# EAGLE design TEST_DCDC (EAGLE 9.6.2)
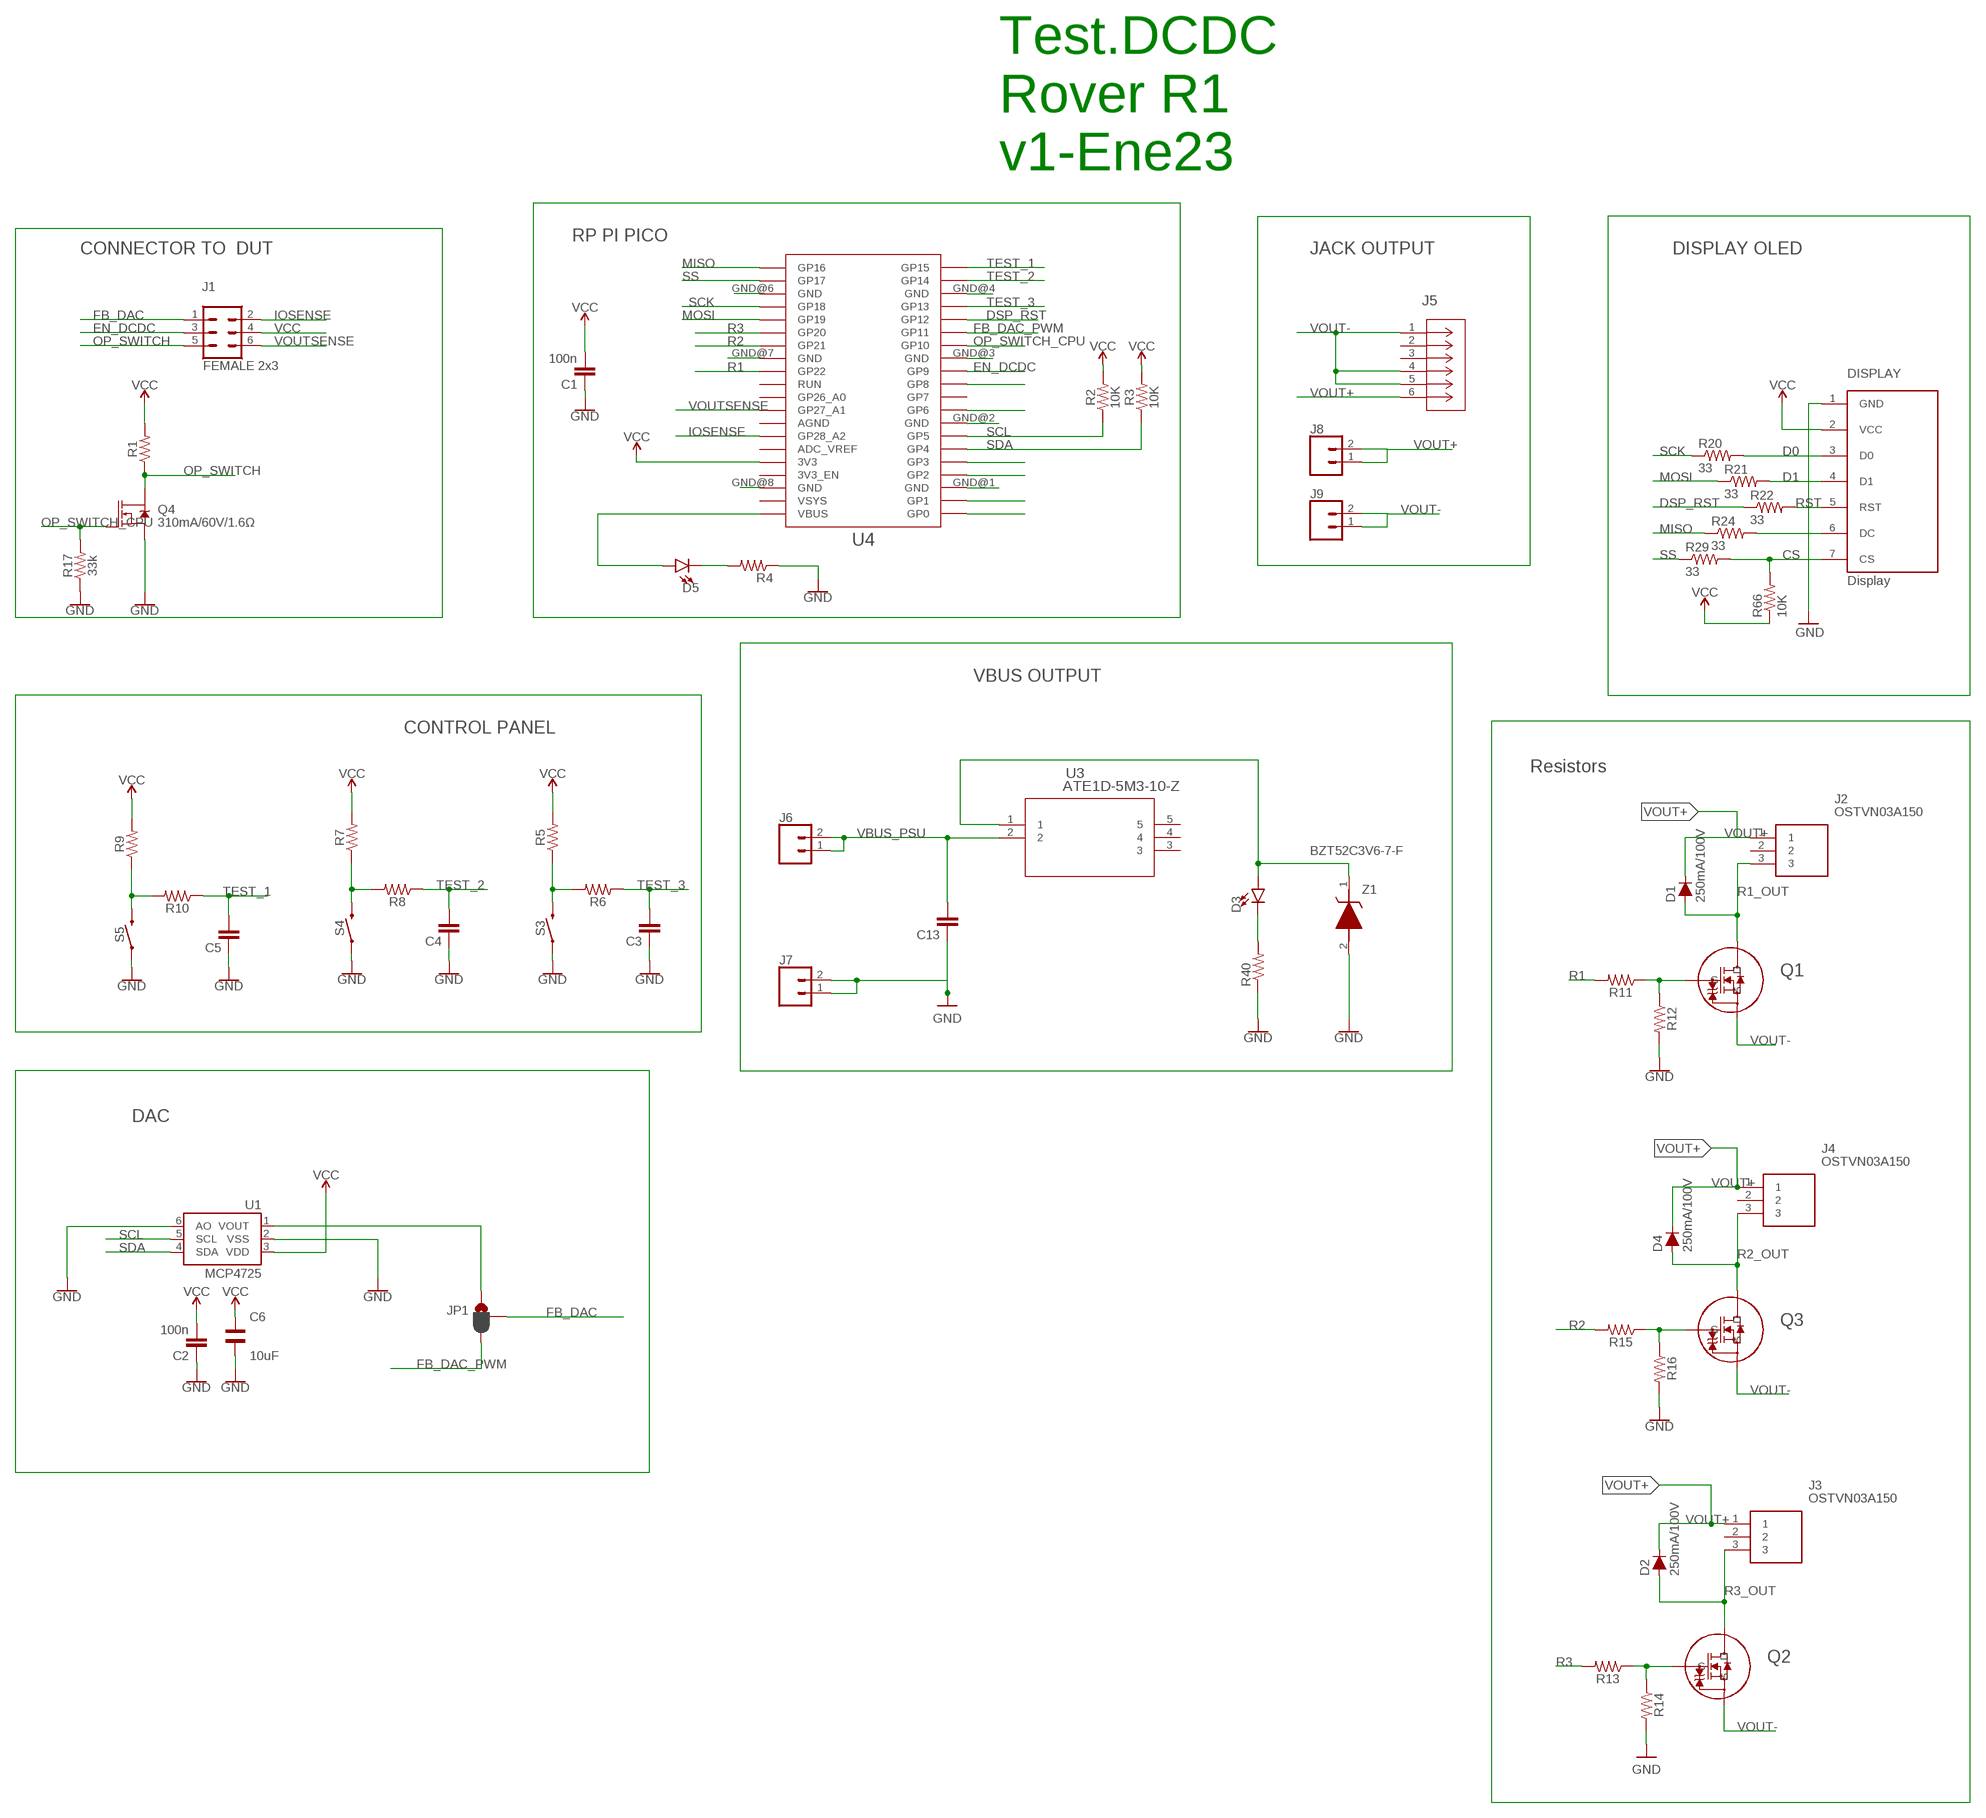
[diagram p0: schematic, sheet 1]

## Parts
C1  100n  C-EUC0805  [C0805]
C2  100n  C-EUC0805  [C0805]
C3  C-EUC0805  [C0805]
C4  C-EUC0805  [C0805]
C5  C-EUC0805  [C0805]
C6  10uF  WCAP-CSGP_1206_885012008001  [WCAP-CSGP_1206]
C13  C-EUC0805  [C0805]
D1  250mA/100V  DIODE-BAS16J  [SOD-323]
D2  250mA/100V  DIODE-BAS16J  [SOD-323]
D3  LED3MM  [LED_3MM]
D4  250mA/100V  DIODE-BAS16J  [SOD-323]
D5  LED3MM  [LED_3MM]
DISPLAY  Display  OLED_LCD  [OLED_LCD]
J1  FEMALE 2x3  CONN_03X2FEMALE  [2X3]
J2  OSTVN03A150  [OSTVN03A150]
J3  OSTVN03A150  [OSTVN03A150]
J4  OSTVN03A150  [OSTVN03A150]
J5  ACJS-MHDR  [CONN_MHDR_AMP]
J6  CONN_02  [1X02]
J7  CONN_02  [1X02]
J8  CONN_02  [1X02]
J9  CONN_02  [1X02]
JP1  JUMPER-SMT_3_1-NC_PASTE_SILK  [SMT-JUMPER_3_1-NC_PASTE_SILK]
Q1  PJA3416AE_R1_00001  [SOT23_PJA3416_PNJ]
Q2  PJA3416AE_R1_00001  [SOT23_PJA3416_PNJ]
Q3  PJA3416AE_R1_00001  [SOT23_PJA3416_PNJ]
Q4  310mA/60V/1.6Ω  MOSFET-NCH-2N7002PW  [SOT323]
R1  RESISTOR0805  [0805]
R2  10K  RESISTOR0805  [0805]
R3  10K  RESISTOR0805  [0805]
R4  10K  RESISTOR0805-RES  [0805]
R5  RESISTOR0805  [0805]
R6  RESISTOR0805  [0805]
R7  RESISTOR0805  [0805]
R8  RESISTOR0805  [0805]
R9  RESISTOR0805  [0805]
R10  RESISTOR0805  [0805]
R11  RESISTOR0805  [0805]
R12  RESISTOR0805  [0805]
R13  RESISTOR0805  [0805]
R14  RESISTOR0805  [0805]
R15  RESISTOR0805  [0805]
R16  RESISTOR0805  [0805]
R17  33k  RESISTOR0805  [0805]
R20  33  RESISTOR0805-RES  [0805]
R21  33  RESISTOR0805-RES  [0805]
R22  33  RESISTOR0805-RES  [0805]
R24  33  RESISTOR0805-RES  [0805]
R29  33  RESISTOR0805-RES  [0805]
R40  10K  RESISTOR0805-RES  [0805]
R66  10K  RESISTOR0805-RES  [0805]
S3  MOMENTARY-SWITCH-SPST-SMD-5.2MM  [TACTILE_SWITCH_SMD_5.2MM]
S4  MOMENTARY-SWITCH-SPST-SMD-5.2MM  [TACTILE_SWITCH_SMD_5.2MM]
S5  MOMENTARY-SWITCH-SPST-SMD-5.2MM  [TACTILE_SWITCH_SMD_5.2MM]
U1  MCP4725  MCP4725SOT-23  [SOT23-6]
U3  ATE1D-5M3-10-Z  [SPDT05_ATE1D_9P5X8_NDC]
U4  RPI_PICO_IG-TH  [RPI_PICO_TH]
Z1  BZT52C3V6-7-F  [SOD3716X135N]

## Nets
CS: DISPLAY.7(CS) R29.2 R66.2
D0: DISPLAY.3(D0) R20.2
D1: DISPLAY.4(D1) R21.2
DSP_RST: R22.1 U4.GP12
EN_DCDC: J1.3 U4.GP9
FB_DAC: J1.1 JP1.2
FB_DAC_PWM: JP1.3 U4.GP11
GND: C1.1 C2.1 C3.1 C4.1 C5.1 C6.1 C13.1 DISPLAY.1(GND) J7.1 J7.2 Q4.2(S) R4.1 R12.2 R14.2 R16.2 R17.1 R40.1 S3.1 S4.1 S5.1 U1.2(VSS) U1.6(AO) U4.GND@1(GND) U4.GND@2(GND) U4.GND@3(GND) U4.GND@4(GND) U4.GND@6(GND) U4.GND@7(GND) U4.GND@8(GND) Z1.2(A)
IOSENSE: J1.2 U4.GP28_A2
MISO: R24.1 U4.GP16
MOSI: R21.1 U4.GP19
N$5: R5.1 R6.2 S3.3
N$6: U4.GP0
N$7: R7.1 R8.2 S4.3
N$9: R9.1 R10.2 S5.3
N$10: U4.GP1
N$13: U4.GP2
N$14: U4.GP3
N$17: DISPLAY.6(DC) R24.2
N$18: JP1.1 U1.1(VOUT)
N$19: Q1.1(G) R11.1 R12.1
N$20: U4.GP6
N$22: U4.GP8
N$24: Q2.1(G) R13.1 R14.1
N$26: D5.K(C) R4.2
N$27: D5.A U4.VBUS
N$28: D3.K(C) R40.2
N$30: Q3.1(G) R15.1 R16.1
OP_SWITCH: J1.5 Q4.3(D) R1.1
OP_SWITCH_CPU: Q4.1(G) R17.2 U4.GP10
R1: R11.2 U4.GP22
R1_OUT: D1.A J2.3 Q1.3(D)
R2: R15.2 U4.GP21
R2_OUT: D4.A J4.3 Q3.3(D)
R3: R13.2 U4.GP20
R3_OUT: D2.A J3.3 Q2.3(D)
RST: DISPLAY.5(RST) R22.2
SCK: R20.1 U4.GP18
SCL: R2.1 U1.5(SCL) U4.GP5
SDA: R3.1 U1.4(SDA) U4.GP4
SS: R29.1 U4.GP17
TEST_1: C5.2 R10.1 U4.GP15
TEST_2: C4.2 R8.1 U4.GP14
TEST_3: C3.2 R6.1 U4.GP13
VBUS: D3.A U3.1 Z1.1(K)
VBUS_PSU: C13.2 J6.1 J6.2 U3.2
VCC: C1.2 C2.2 C6.2 DISPLAY.2(VCC) J1.4 R1.2 R2.2 R3.2 R5.2 R7.2 R9.2 R66.1 U1.3(VDD) U4.3V3
VOUT+: D1.C D2.C D4.C J2.1 J3.1 J4.1 J5.6 J8.1 J8.2
VOUT-: J5.1 J5.4 J5.5 J9.1 J9.2 Q1.2(S) Q2.2(S) Q3.2(S)
VOUTSENSE: J1.6 U4.GP27_A1
Unconnected: J2.2 J3.2 J4.2 J5.2 J5.3 U3.3 U3.4 U3.5 U4.3V3_EN U4.ADC_VREF U4.AGND U4.GP7 U4.GP26_A0 U4.RUN U4.VSYS

## Notes on the sheet
- Test.DCDC
  Rover R1
  v1-Ene23
- RP PI PICO
- CONNECTOR TO  DUT | JACK OUTPUT | DISPLAY OLED
- VBUS OUTPUT
- CONTROL PANEL
- Resistors
- DAC

## Library data of the parts
C1-C5 C13 = rcl:C-EU: CAPACITOR, European symbol; SPICEPREFIX: C
C6 = Wurth_Elektronik_Passive_Capacitors_rev19a:WCAP-CSGP_1206: WCAP-CSGP Ceramic Capacitors Characteristics Multilayer Ceramic Chip Capacitor Recommended soldering:Reflow, for 0603 and 0805 wave soldering is also allowed Operating temperature:-55 °C to +125 °C; Ceramic characteristics: Class I - NPO ; Class II -X7R, X5R High performance ceramic High capacitance stability Minimal aging Termination:Cu/Ni/Sn <http://katalog.we-online.de/media/images/eisos/WCAP-CSGP_pf2.jpg> Details see: http://katalog.we-online.de/en/pbs/WCAP-CSGP-1206? Created: 2015-01-28 2015 (C) Wurth Elektronik
D1 D2 D4 = SparkFun-DiscreteSemi:DIODE: Diode These are standard reverse protection diodes and small signal diodes. SparkFun Products: SparkFun SparkPunk Sound Kit <https://www.sparkfun.com/products/11177> SparkFun ESP8266 Thing <https://www.sparkfun.com/products/13231>; PROD_ID: DIO-09646
D3 D5 = SparkFun-LED:LED: LED (Generic) Standard schematic elements and footprints for 5mm, 3mm, 1206, and 0603 sized LEDs. Generic LEDs with no color specified.; PROD_ID: DIO-08794
DISPLAY = EDCPSU:OLED_LCD
J1 = SparkFun-Connectors:CONN_03X2: Multi connection point. Often used as Generic Header-pin footprint for 0.1 inch spaced/style header connections You can populate with any combo of single row headers, but if you'd like an exact match, check these: Header - 2x3 (Male, 0.1") <https://www.sparkfun.com/products/12807> (PRT-12807) Header - 2x3 (Female, 0.1") <https://www.sparkfun.com/products/13010> (PRT-13010) 2x3 Pin Shrouded Header <https://www.sparkfun.com/products/10877> (PRT-10877) On any of the 0.1 inch spaced packages, you can populate with these: Break Away Headers - Straight <https://www.sparkfun.com/products/116> (PRT-00116) Break Away Male Headers - Right Angle <https://www.sparkfun.com/products/553> (PRT-00553) Female Headers <https://www.sparkfun.com/products/115> (PRT-00115) Break Away Headers - Machine Pin <https://www.sparkfun.com/products/117> (PRT-00117) Break Away Female Headers - Swiss Machine Pin <https://www.sparkfun.com/products/743> (PRT-00743) Special note: the shrouded connector mates well with our 3x2 ribbon cables: Ribbon Crimp Connector - 6-pin (2x3, Female) <https://www.sparkfun.com/products/10651> (PRT-10651) Ribbon Cable - 6 wire (15ft) <https://www.sparkfun.com/products/10646> (PRT-10646); PROD_ID: CONN-11566
J2-J4 = OSTVN03A150:OSTVN03A150: OSTVN03A150 Source: Datasheet <https://www.on-shore.com/wp-content/uploads/OSTVNXXA150.pdf>; ARROW_PART_NUMBER: OSTVN03A150; ARROW_PRICE-STOCK: https://www.arrow.com/en/products/ostvn03a150/on-shore-technology; DESCRIPTION: OSTVN03A150; HEIGHT: 8.8mm; MANUFACTURER_NAME: On-Shore Technology, Inc; MANUFACTURER_PART_NUMBER: OSTVN03A150
J5 = ACJSMHDR:ACJS-MHDR; BUILT_BY: EMA_Matt; COPYRIGHT: Copyright (C) 2018 Accelerated Designs. All rights reserved; MANUFACTURER_PART_NUMBER: ACJS-MHDR; SOURCELIBRARY: Amphenol_2019-10-30; VENDOR: Amphenol
J6-J9 = SparkFun-Connectors:CONN_02: Multi connection point. Often used as Generic Header-pin footprint for 0.1 inch spaced/style header connections On any of the 0.1 inch spaced packages, you can populate with these: Break Away Headers - Straight <https://www.sparkfun.com/products/116> (PRT-00116) Break Away Male Headers - Right Angle <https://www.sparkfun.com/products/553> (PRT-00553) Female Headers <https://www.sparkfun.com/products/115> (PRT-00115) Break Away Headers - Machine Pin <https://www.sparkfun.com/products/117> (PRT-00117) Break Away Female Headers - Swiss Machine Pin <https://www.sparkfun.com/products/743> (PRT-00743) For SCREWTERMINALS and SPRING TERMINALS visit here: Screw Terimnals on SparkFun.com <https://www.sparkfun.com/search/results?term=Screw+Terminals> (5mm/3.5mm/2.54mm spacing) This device is also useful as a general connection point to wire up your design to another part of your project. Our various solder wires solder well into these plated through hole pads. Hook-Up Wire - Assortment (Stranded, 22 AWG) <https://www.sparkfun.com/products/11375> (PRT-11375) Hook-Up Wire - Assortment (Solid Core, 22 AWG) <https://www.sparkfun.com/products/11367> (PRT-11367) View the entire wire category on our website here <https://www.sparkfun.com/categories/141> Special notes: Molex polarized connector foot print use with: PRT-08233 with associated crimp pins and housings. 2.54_SCREWTERM for use with PRT-10571. 3.5mm Screw Terminal footprints for PRT-08084 5mm Screw Terminal footprints for use with PRT-08432
JP1 = SparkFun-Jumpers:JUMPER-SMT_3_1-NC_PASTE: Normally closed solder jumper (1 of 2 connections) This jumper has an aperture in the stencil to allow solder paste to bridge one of the two connections. One connection is normally closed (NC), while the other is normally open (NO). Wick off the solder to open the connection. Reapply solder to reclose the connection. Apply solder to the other side instead to change the current path.
Q1-Q3 = PJA3416AE_R1_00001:PJA3416AE_R1_00001; COPYRIGHT: Copyright (C) 2022 Ultra Librarian. All rights reserved.; DIGI-KEY_PART_NUMBER_1: 3757-PJA3416AE_R1_00001TR-ND; DIGI-KEY_PART_NUMBER_2: 3757-PJA3416AE_R1_00001CT-ND; DIGI-KEY_PART_NUMBER_3: 3757-PJA3416AE_R1_00001DKR-ND; MANUFACTURER_PART_NUMBER: PJA3416AE_R1_00001; MFR_NAME: Panjit
Q4 = SparkFun-DiscreteSemi:MOSFET-NCH: N-channel MOSFETs Voltage controlled devices that allow control of high current outputs. SparkFun Products: SparkFun OpenScale <https://www.sparkfun.com/products/13261> SparkFun Digital Sandbox <https://www.sparkfun.com/products/12651> SparkFun Monster Moto Shield <https://www.sparkfun.com/products/10182> SparkFun MOSFET Power Controller <https://www.sparkfun.com/products/11214>; PROD_ID: TRANS-11151
R1-R3 R5-R17 = SparkFun-Resistors:RESISTOR: Generic Resistor Package
R4 R20-R22 R24 R29 R40 R66 = SparkFun:RESISTOR: Resistor Basic schematic elements and footprints for 0603, 1206, and PTH resistors.
S3-S5 = SparkFun-Switches:MOMENTARY-SWITCH-SPST: Momentary Switch (Pushbutton) - SPST Normally-open (NO) SPST momentary switches (buttons, pushbuttons). Variants PTH-12MM - 12mm square, through-hole Momentary Pushbutton Switch - 12mm Square <https://www.sparkfun.com/products/9190> (COM-09190) PTH-6.0MM, PTH-6.0MM-KIT - 6.0mm square, through-hole Mini Pushbutton Switch <https://www.sparkfun.com/products/97> (COM-00097) KIT package intended for soldering kit's - only one side of pads' copper is exposed. PTH-RIGHT-ANGLE-KIT - Right-angle, through-hole Right Angle Tactile Button <https://www.sparkfun.com/products/10791> - Used on SparkFun BigTime Watch Kit <https://www.sparkfun.com/products/11734> SMD-12MM - 12mm square, surface-mount Tactile Button - SMD (12mm) <https://www.sparkfun.com/products/12993> (COM-12993) Used on SparkFun PicoBoard <https://www.sparkfun.com/products/11888> SMD-4.5MM - 4.5mm Square Trackball Switch Used on SparkFun Blackberry Trackballer Breakout <https://www.sparkfun.com/products/13169> SMD-4.6MMX2.8MM - 4.60mm x 2.80mm, surface mount Used on SparkFun SAMD21 Mini Breakout <https://www.sparkfun.com/products/13664> SMD-5.2MM, SMD-5.2-REDUNDANT - 5.2mm square, surface-mount Mini Pushbutton Switch - SMD <https://www.sparkfun.com/products/8720> (COM-08720) Used on Arduino Pro Mini <https://www.sparkfun.com/products/11114> REDUNDANT package connects both switch circuits together SMD-6.0X3.5MM - 6.0 x 3.5mm, surface mount Momentary Reset Switch SMD <https://www.sparkfun.com/products/8229> (COM-08229) SMD-6.2MM-TALL - 6.2mm square, surface mount Tactile Button - SMD (6mm) <https://www.sparkfun.com/products/12992> Used on SparkFun Digital Sandbox <https://www.sparkfun.com/products/12651> SMD-RIGHT-ANGLE - Right-angle, surface mount Used on SparkFun Block for Intel® Edison - Arduino <https://www.sparkfun.com/products/13036>; PROD_ID: SWCH-08247; SF_SKU: COM-08720
U1 = SparkFun-IC-Conversion:MCP4725: MCP4725 DAC Microchip 12-bit I2C DAC, SOT23-6 Datasheet <https://cdn.sparkfun.com/datasheets/BreakoutBoards/MCP4725_2009.pdf> SparkFun Products SparkFun I2C DAC Breakout - MCP4725 <https://www.sparkfun.com/products/12918> (BOB-12918); PROD_ID: IC-08886
U3 = ATE1D-5M3-10-Z:ATE1D-5M3-10-Z; COPYRIGHT: Copyright (C) 2022 Ultra Librarian. All rights reserved.; DIGI-KEY_PART_NUMBER_1: 563-1158-ND; MANUFACTURER_PART_NUMBER: ATE1D-5M3-10-Z; MFR_NAME: Nidec Copal Electronics
U4 = RaspberryPi_Pico:RPI_PICO_IG
Z1 = BZT52C3V6-7-F:BZT52C3V6-7-F: Diodes Inc BZT52C3V6-7-F Zener Diode, 3.6V 6% 500 mW SMT 2-Pin SOD-123 Source: Datasheet <https://www.diodes.com/assets/Datasheets/ds18004.pdf>; ARROW_PART_NUMBER: BZT52C3V6-7-F; ARROW_PRICE-STOCK: https://www.arrow.com/en/products/bzt52c3v6-7-f/diodes-incorporated?region=nac; DESCRIPTION: Diodes Inc BZT52C3V6-7-F Zener Diode, 3.6V 6% 500 mW SMT 2-Pin SOD-123; HEIGHT: 1.35mm; MANUFACTURER_NAME: Diodes Inc.; MANUFACTURER_PART_NUMBER: BZT52C3V6-7-F; MOUSER_PART_NUMBER: 621-BZT52C3V6-F; MOUSER_PRICE-STOCK: https://www.mouser.co.uk/ProductDetail/Diodes-Incorporated/BZT52C3V6-7-F?qs=We1mx2pNWM9dxcfB67aIQA%3D%3D

## Board
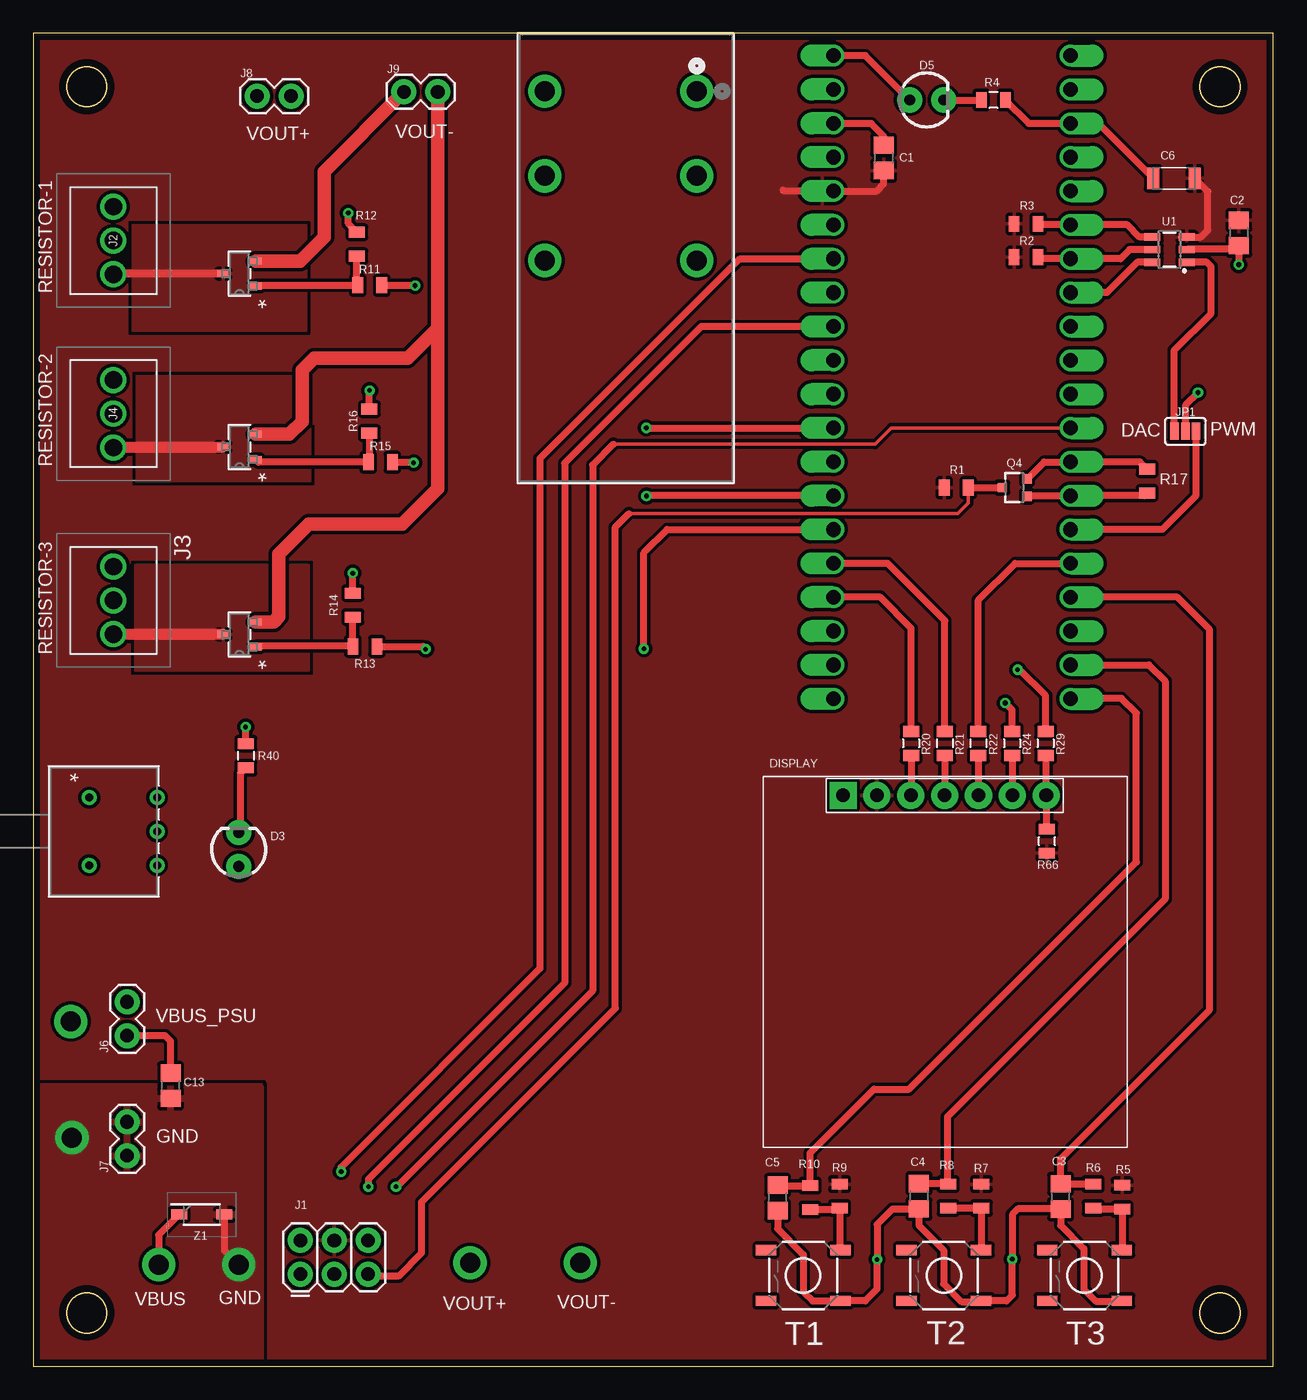
[diagram p1: board, top side]
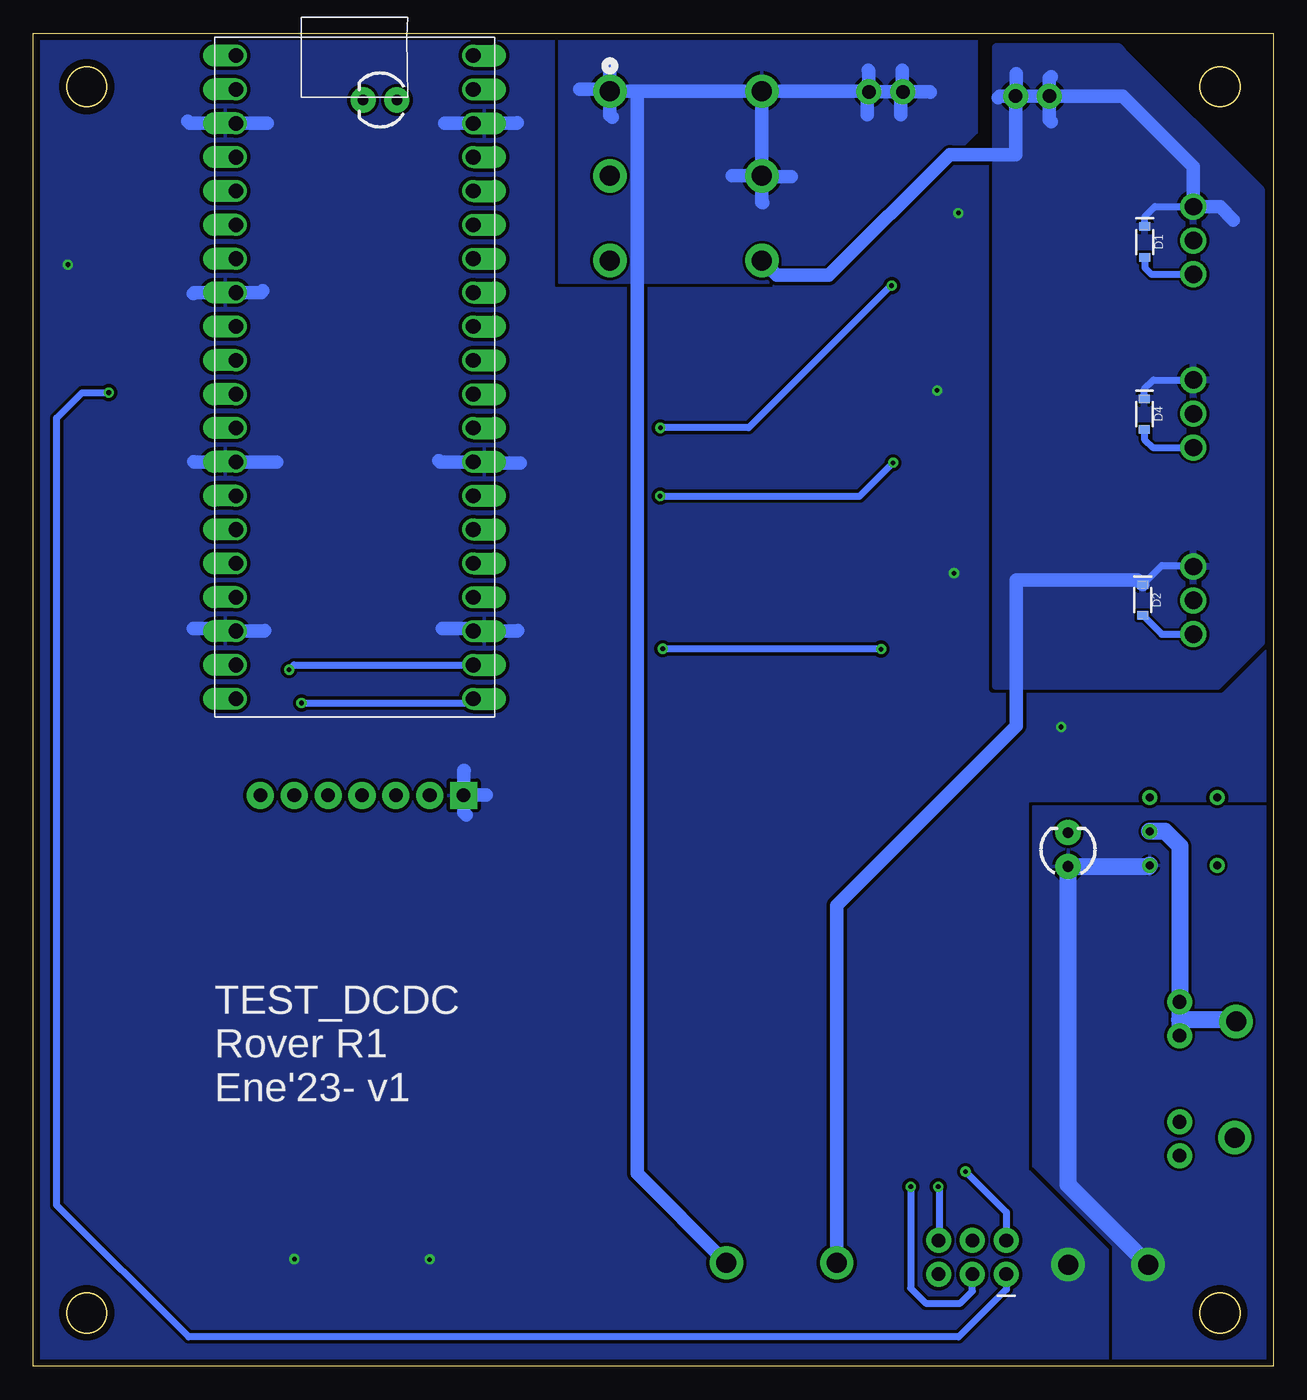
[diagram p2: board, bottom side, seen from below]

Size 93 x 100 mm. Coordinates in mm from the lower left corner, seen from the top.
Outline: 0,0 93,0 93,100 0,100 0,0
Outline: circle at 89,4 radius 1.5
Outline: circle at 89,96 radius 1.5
Outline: circle at 4,96 radius 1.5
Outline: circle at 4,4 radius 1.5
Copper layers (1*16): Top 0.035mm / dielectric 1.5mm / Bottom 0.035mm
Design rules "default *": minimum track width 6mil, minimum drill 0.35mm, track to track 8mil, track to pad 8mil, pad to pad 8mil, via to via 8mil, smd to smd 0mil, copper to edge 20mil, drill to drill 6mil, minimum pad ring 10mil, minimum via ring 8mil, stop-mask expansion 4mil, vias tented up to drill 0mil, thermal gap 10mil

### Footprints (pad centres in the part's own frame; a part is rotated, then mirrored left to right if it is on the bottom)
C0805 = smd 1.3 x 1.5: 1 -0.95,0; 2 0.95,0
WCAP-CSGP_1206 = smd 0.9 x 1.6: 1 -1.55,0; 2 1.55,0
SOD-323 = smd 0.63 x 0.83: A 1.15,0; C -1.15,0
LED_3MM = drill 0.813 pad 1.88: A -1.27,0; K 1.27,0
OLED_LCD = drill 1.016 pad 2.032 square: 1 -7.42,13.7 | drill 1.016 pad 2.032: 2 -4.88,13.7; 3 -2.34,13.7; 4 0.2,13.7; 5 2.74,13.7; 6 5.28,13.7; 7 7.82,13.7
2X3 = drill 1.016 pad 1.88: 1 0,0; 2 0,2.54; 3 2.54,0; 4 2.54,2.54; 5 5.08,0; 6 5.08,2.54
OSTVN03A150 = drill 1.3 pad 1.95: 1 0,0; 2 2.54,0; 3 5.08,0
CONN_MHDR_AMP = drill 1.5 pad 2.5: 1 0,0; 2 -6.35,0; 3 -12.7,0; 4 0,11.405; 5 -6.35,11.405; 6 -12.7,11.405
1X02 = drill 1.016 pad 1.88: 1 0,0; 2 2.54,0
SMT-JUMPER_3_1-NC_PASTE_SILK = smd 0.635 x 1.27: 1 -0.813,0; 2 0,0; 3 0.813,0
SOT23_PJA3416_PNJ = smd 0.864 x 0.508: 1 -1.232,0.95; 2 -1.232,-0.95; 3 1.232,0
SOT323 = smd 0.7 x 0.7: 1 -0.65,-0.925; 2 0.65,-0.925; 3 0,0.925
0805 = smd 0.8 x 1.2: 1 -0.9,0; 2 0.9,0
TACTILE_SWITCH_SMD_5.2MM = smd 1.524 x 0.762: 1 -2.794,1.905; 2 2.794,1.905; 3 -2.794,-1.905; 4 2.794,-1.905
SOT23-6 = smd 0.55 x 1.2: 1 0.95,1.3; 2 0,1.3; 3 -0.95,1.3; 4 -0.95,-1.3; 5 0,-1.3; 6 0.95,-1.3
SPDT05_ATE1D_9P5X8_NDC = drill 0.61 pad 1.118: 1 5.08,5.08; 2 2.54,5.08; 3 0,5.08; 4 0,0; 5 5.08,0
RPI_PICO_TH = drill 1.1 pad 1.6 offset: 3V3 8.89,13.97; 3V3_EN 8.89,16.51; ADC_VREF 8.89,11.43; AGND 8.89,6.35; GND@1 -8.89,19.05; GND@2 -8.89,6.35; GND@3 -8.89,-6.35; GND@4 -8.89,-19.05; GND@6 8.89,-19.05; GND@7 8.89,-6.35; GND@8 8.89,19.05; GP0 -8.89,24.13; GP1 -8.89,21.59; GP2 -8.89,16.51; GP3 -8.89,13.97; GP4 -8.89,11.43; GP5 -8.89,8.89; GP6 -8.89,3.81; GP7 -8.89,1.27; GP8 -8.89,-1.27; GP9 -8.89,-3.81; GP10 -8.89,-8.89; GP11 -8.89,-11.43; GP12 -8.89,-13.97; GP13 -8.89,-16.51; GP14 -8.89,-21.59; GP15 -8.89,-24.13; GP16 8.89,-24.13; GP17 8.89,-21.59; GP18 8.89,-16.51; GP19 8.89,-13.97; GP20 8.89,-11.43; GP21 8.89,-8.89; GP22 8.89,-3.81; GP26_A0 8.89,1.27; GP27_A1 8.89,3.81; GP28_A2 8.89,8.89; RUN 8.89,-1.27; VBUS 8.89,24.13; VSYS 8.89,21.59
SOD3716X135N = smd 1.2 x 0.75: 1 -1.7,0; 2 1.7,0

### Placement (x,y rotation side)
C1  63.78,90.65 270 top
C2  90.41,85.02 90 top
C3  77.04,12.73 90 top
C4  66.41,12.76 90 top
C5  55.82,12.63 90 top
C6  85.54,89.12 0 top
C13  10.3,21.04 90 top
D1  9.64,84.35 270 bottom
D2  9.8,57.49 270 bottom
D3  15.4,38.76 90 top
D4  9.67,71.44 270 bottom
D5  67,95 0 top
DISPLAY  68.15,29.13 0 top
J1  20.03,6.9 0 top
J2  6,87 270 top
J3  6,60 270 top
J4  6,74 270 top
J5  49.76,95.65 90 top
J6  7.03,24.79 90 top
J7  7.03,15.79 90 top
J8  16.79,95.29 0 top
J9  27.79,95.61 0 top
JP1  86.4,70.14 0 top
Q1  15.46,81.97 180 top
Q2  15.46,54.9 180 top
Q3  15.46,68.97 180 top
Q4  73.6,65.92 90 top
R1  69.22,65.91 180 top
R2  74.46,83.2 180 top
R3  74.46,85.7 180 top
R4  72,95 180 top
R5  81.65,12.68 90 top
R6  79.49,12.76 270 top
R7  71.11,12.76 90 top
R8  68.61,12.76 270 top
R9  60.48,12.76 90 top
R10  58.26,12.65 270 top
R11  25.23,81.1 0 top
R12  24.27,84.18 90 top
R13  24.86,54 0 top
R14  23.97,57.1 90 top
R15  26.02,67.83 0 top
R16  25.2,70.91 90 top
R17  83.53,66.41 270 top
R20  65.84,46.72 270 top
R21  68.36,46.72 270 top
R22  70.88,46.72 270 top
R24  73.4,46.72 270 top
R29  75.92,46.72 270 top
R40  15.94,45.8 270 top
R66  76.02,39.39 90 top
S3  78.84,6.81 180 top
S4  68.29,6.81 180 top
S5  57.74,6.81 180 top
U1  85.22,83.77 270 top
U3  4.2,42.66 270 top
U4  68.9,74.2 0 bottom
Z1  12.63,11.38 0 top

### Tracks (layer width: path | path; a pad name or v marks a point on that pad's centre or on a via)
CS
  Top 0.508: R66.2 76.02,42.78 DISPLAY.7 75.97,45.77 R29.2
D0
  Top 0.508: R20.2 65.84,42.86 DISPLAY.3
D1
  Top 0.508: R21.2 DISPLAY.4
DSP_RST
  Top 0.508: R22.1 70.88,57.47 73.64,60.23 U4.GP12
EN_DCDC  (via drill 0.35)
  Top 0.254: U4.GP9 64.34,70.39 63.13,69.18 43.51,69.18
  Top 0.508: 43.51,69.18 41.94,67.61 41.94,28.16 27.25,13.47 v27.2,13.47
  Bottom 0.508: v27.2,13.47 27.2,5.86 26.07,4.73 23.47,4.73 22.57,5.63 J1.3
FB_DAC  (via drill 0.35)
  Top 0.508: JP1.2 86.4,72.09 v87.35,73.04
  Bottom 0.508: J1.1 20.03,5.76 23.6,2.19 81.36,2.19 91.25,12.08 91.25,71.14 89.35,73.04 v87.35,73.04
FB_DAC_PWM
  Top 0.508: JP1.3 87.21,65.32 84.66,62.77 U4.GP11
GND  (via drill 0.35, 1.5 pad 2.5)
  Top 0.508: C5.1 55.82,10.31 57.76,8.37 57.76,5.59 58.45,4.91 S5.1 62.4,4.91 63.28,5.79 v63.28,8.01 63.28,10.64 64.42,11.78 66.38,11.78 C4.1 66.41,10.58 68.28,8.71 68.28,6.17 69.6,4.85 71.03,4.85 S4.1 73,4.91 73.42,5.32 v73.42,8.04 73.42,11.39 73.83,11.8 77.02,11.8 C3.1 77.04,10.56 78.79,8.81 78.79,5.76 79.67,4.88 81.61,4.88 S3.1 | R40.1 15.94,47.94 v15.92,47.96 | Z1.2 14.33,8.69 v15.4,7.62 | R14.2 23.97,59.48 v23.95,59.5 | R16.2 25.2,73.18 v25.22,73.2 | R12.2 23.62,85.73 v23.62,86.52 | C1.1 63.78,92.3 62.85,93.23 60.03,93.23 U4.GND@8 | R4.1 74.65,93.25 77.08,93.25 U4.GND@1 79.86,93.25 C6.1 | Q4.2 75.81,67.85 U4.GND@3 82.99,67.85 R17.1 | U1.2 86.54,83.79 90.13,83.79 C2.1 v90.41,82.64 | U1.6 82.78,82.82 80.51,80.55 U4.GND@2
  Bottom 1.016: 56.7,93.31 56.76,93.25 U4.GND@8 62.14,93.25 62.15,93.24 | 81.43,93.4 81.28,93.25 U4.GND@1 75.46,93.25 75.44,93.27 | 75.79,80.68 75.92,80.55 U4.GND@2 80.92,80.55 81,80.47 | 62.6,67.96 62.49,67.85 U4.GND@7 59.91,67.75 56.48,67.75 | 80.97,67.88 80.94,67.85 U4.GND@3 74.75,67.85 | 81.02,55.34 77.98,55.34 U4.GND@4 75.69,55.15 75.63,55.21 | 62.34,55.34 60.2,55.34 U4.GND@6 56.72,55.15 56.66,55.21 | DISPLAY.1 60.73,44.68 60.7,44.71 | DISPLAY.1 60.7,42.86 59.03,42.86 | DISPLAY.1 60.73,41.55 60.52,41.34
  other vias: 2.89,17.15
  pour Top (isolate 0.254): -3,21 17,21 17,-3 -2,-3 -3,-2
  pour Bottom (isolate 0.254, rank 2): -5.24,103.33 -5.45,-3.78 101.83,-3.78 101.83,103.33
IOSENSE  (via drill 0.35)
  Top 0.508: U4.GP28_A2 59.97,83.05 52.95,83.05 37.99,68.1 37.99,29.83 23.09,14.93 v23.09,14.6
  Bottom 0.508: v23.09,14.6 v23.08,14.6 20.03,11.55 J1.2
MISO  (via drill 0.35)
  Top 0.508: R24.1 73.4,49.25 v72.89,49.76
  Bottom 0.508: v72.89,49.76 60.32,49.76 U4.GP16
MOSI
  Top 0.508: R21.1 68.36,55.94 64.07,60.23 U4.GP19
N$5
  Top 0.508: R6.2 79.57,11.78 R5.1 81.65,8.73 S3.3
N$7
  Top 0.508: R8.2 R7.1 71.11,8.74 S4.3
N$9
  Top 0.508: R10.2 60.37,11.75 R9.1 60.48,8.77 S5.3
N$17
  Top 0.508: R24.2 73.4,42.86 DISPLAY.6
N$18
  Top 0.508: JP1.1 85.59,76.24 88.33,78.98 88.33,82.51 88.02,82.82 U1.1
N$19
  Top 0.508: Q1.1 16.77,81.1 R11.1 24.27,81.16 R12.1
N$24
  Top 0.508: Q2.1 16.79,54.05 23.91,54.05 R13.1 R14.1
N$26
  Top 0.508: D5.K R4.2
N$27
  Top 0.508: D5.A 62.4,98.33 U4.VBUS
N$28
  Top 0.508: D3.K 15.52,40.15 15.52,44.48 R40.2
N$30
  Top 0.508: R16.1 25.2,67.91 R15.1 16.88,67.83 Q3.1
OP_SWITCH
  Top 0.254: R1.1 70.12,64.75 69.33,63.96 44.66,63.96
  Top 0.508: R1.1 Q4.3 | J1.5 25.25,6.76 27.4,6.76 29.13,8.49 29.13,12.32 43.66,26.85 43.66,62.96 44.66,63.96
OP_SWITCH_CPU
  Top 0.508: Q4.1 74.56,65.31 U4.GP10 83.33,65.31 R17.2
R1  (via drill 0.35)
  Top 0.508: R11.2 28.6,81.1 v28.63,81.07 | v45.97,70.4 v45.98,70.39 U4.GP22
  Bottom 0.508: v28.63,81.07 28.69,81.07 39.36,70.4 v45.97,70.4
R1_OUT
  Top 0.508: 6.05,81.97 J2.3
  Top 0.61: Q1.3 6.05,81.97
  Bottom 0.508: D1.A 9.64,82.41 9.15,81.92 J2.3
  pour Top (isolate 0.254): 7.4,85.6 7.4,77.7 20.5,77.7 20.5,85.6
R2  (via drill 0.35)
  Top 0.508: U4.GP21 45.99,65.31 v45.99,65.28 | v28.52,67.78 26.98,67.78 R15.2
  Bottom 0.508: v45.99,65.28 31.02,65.28 v28.52,67.78
R2_OUT
  Top 0.508: J4.3 6.05,68.97
  Top 0.813: 6.05,68.97 Q3.3
  Bottom 0.508: D4.A 9.67,69.53 9.06,68.92 J4.3
  pour Top (isolate 0.254): 7.7,74.3 7.7,66.4 20.8,66.4 20.8,74.3
R3  (via drill 0.35)
  Top 0.508: U4.GP20 47.53,62.77 45.8,61.03 v45.8,53.83 | R13.2 29.22,54 v29.42,53.8
  Bottom 0.508: v29.42,53.8 45.62,53.8 45.72,53.9 v45.8,53.83
R3_OUT
  Top 0.508: J3.3 6.02,54.9
  Top 0.813: Q2.3 6.02,54.9
  Bottom 0.508: D2.A 8.38,54.92 J3.3
  pour Top (isolate 0.254): 7.6,60.1 7.6,52.2 20.7,52.2 20.7,60.1
RST
  Top 0.508: R22.2 DISPLAY.5
SCK
  Top 0.508: R20.1 65.84,55.35 63.5,57.69 U4.GP18
SCL
  Top 0.508: U1.5 82.22,83.77 81.54,83.09 U4.GP5 75.47,83.09 R2.1
SDA
  Top 0.508: U1.4 82.96,84.72 82.05,85.63 U4.GP4 75.43,85.63 R3.1
SS  (via drill 0.35)
  Top 0.508: R29.1 75.92,50.31 73.98,52.25 v73.82,52.25
  Bottom 0.508: v73.82,52.25 73.46,52.61 U4.GP17
TEST_1
  Top 0.508: C5.2 55.85,13.55 R10.1 58.26,15.99 63.04,20.77 65.67,20.77 82.72,37.82 82.72,48.99 81.61,50.1 77.82,50.1 U4.GP15
TEST_2
  Top 0.508: C4.2 68.56,13.71 | 68.56,13.71 R8.1 | U4.GP14 83.67,52.61 84.89,51.39 84.89,35.04 68.56,18.71 68.56,13.71
TEST_3
  Top 0.508: R6.1 79.47,13.68 C3.2 77.04,15.56 88.22,26.74 88.22,55.26 85.79,57.69 U4.GP13
VBUS  (via drill 1.5 pad 2.5)
  Top 0.508: Z1.1 9.4,9.85 v9.4,7.62
  Bottom 0.305: U3.1 9.28,38.08
  Bottom 1.27: v9.4,7.62 15.4,13.62 D3.A 9.37,37.49 U3.1
  pour Bottom: -3,42 18,42 18,15 12,9 12,-0.12 -3,-0.12
VBUS_PSU  (via drill 1.5 pad 2.5)
  Top 0.508: C13.2 10.3,24.37 9.88,24.79 J6.1
  Bottom 1.27: U3.2 8.12,40.12 7,39 7,27.36 J6.2 7.03,26 | 7.03,26 J6.1 | v2.8,25.86 2.94,26 7.03,26
VCC
  Top 0.508: U1.3 87.56,84.72 88.09,85.25 88.09,88.12 C6.2 | C1.2 63.78,88.7 63.25,88.17 U4.3V3 56.29,88.17 56.21,88.25
  pour Top (isolate 0.254, rank 2): -5.24,103.33 -5.45,-3.89 102.45,-3.89 102.45,103.33
VOUT+  (via drill 1.5 pad 2.5)
  Bottom 0.508: D2.C 8.36,60.08 6.08,60.08 J3.1 | D1.C 9.64,86.25 8.89,87 J2.1 | D4.C 9.67,73.33 9,74 J4.1
  Bottom 1.016: v32.75,7.76 32.75,34.58 19.29,48.04 19.29,59 10.16,59 D2.C | J8.2 19.33,90.91 24.25,90.91 33.33,81.84 37.24,81.84 J5.6 | J8.2 J8.1 | J8.1 11.29,95.29 6,90 J2.1 4,87 3,86 | J8.2 19.29,95.33 19.29,96.95 | J8.1 16.79,96.63 16.66,96.76 | J8.1 16.79,93.51 16.66,93.38 | J8.2 20.51,95.29 20.62,95.18
  pour Bottom: 11.42,98.86 11.55,98.99 20.85,98.99 20.85,51.02 4.15,51.02 0.88,54.29 0.88,88.26 11.29,98.67
VOUT-  (via drill 1.5 pad 2.5)
  Top 1.016: 30.33,77.89 28.08,75.64 21.08,75.64 20.17,74.73 20.17,70.88 19.21,69.92 Q3.2 | 30.33,77.89 J9.2 | Q1.2 20,82.92 21.8,84.72 21.8,89.62 J9.1 | Q2.2 18.02,55.85 18.4,56.23 18.4,60.92 20.65,63.17 27.66,63.17 30.33,65.84 30.33,77.89
  Bottom 1.016: v41.02,7.76 47.71,14.45 47.71,95.03 | J5.5 38.3,89.3 38.35,89.36 J5.4 | J5.1 J5.4 | J5.4 38,96 38.01,96 J5.4 | J9.2 30.37,95.65 J5.4 | J5.5 38.31,89.26 36.17,89.26 | J5.5 38.38,89.33 40.59,89.33 | J5.5 38.35,87.33 38.3,87.28 | J9.2 30.33,97.17 30.38,97.22 | J9.2 30.44,95.5 30.44,93.91 | J9.2 J9.1 | J9.1 27.84,95.66 27.84,97.22 | J9.1 27.93,95.47 27.93,93.91 | J9.1 25.76,95.61 25.73,95.58 | J5.1 49.76,97.35 | J5.1 49.91,95.8 52.02,95.8 | J5.1 49.76,93.85 49.6,93.69
  pour Bottom: 22.24,99.61 53.54,99.61 53.54,81.28 33.5,81.28 22.24,92.54
VOUTSENSE  (via drill 0.35)
  Top 0.508: v25.13,13.47 25.13,14.03 39.85,28.75 39.85,67.75 50.11,78.01 U4.GP27_A1
  Bottom 0.508: v25.13,13.47 25.04,13.38 25.04,9.51 J1.6

### Text on the board
tNames: VOUT+ | VOUT- | RESISTOR-1 | DAC | PWM | RESISTOR-2 | RESISTOR-3 | VBUS_PSU | GND | VBUS | GND | VOUT+ | VOUT- | T1 | T2 | T3
bNames: TEST_DCDC / Rover R1 / Ene'23- v1